# Altium schematic sheet 5V_Source.SchDoc
size A4
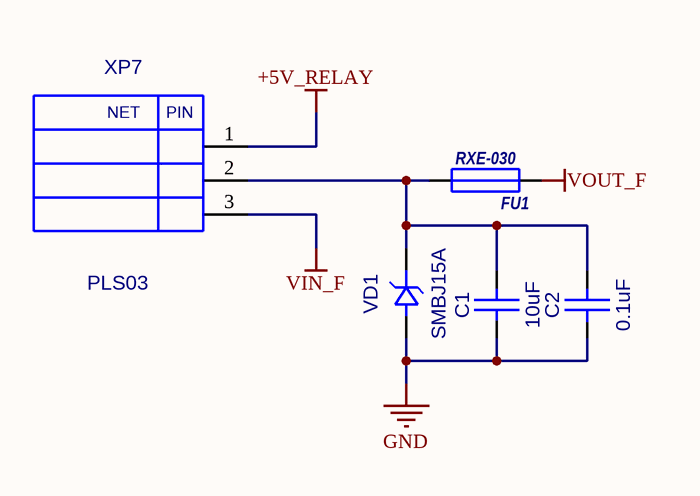
[diagram p0: 5V_Source.SchDoc]

## Parts
C1  10uF  [CC0805]
C2  0.1uF  [CC0603]
FU1  RXE-030  [RXE-110]
VD1  SMBJ15A  [SMB]
XP7  PLS03  [PLS-03]

## Nets
+5V_RELAY: XP7.1
GND: C1.1(A) C2.1(A) VD1.1(A)
VIN_F: XP7.3
VOUT_F: FU1.1
NetC1_2: C1.2(B) C2.2(B) FU1.2 VD1.2(K) XP7.2

## Notes on the sheet
- (in symbol PLS03) NET; PIN

## Library data of the parts
C1 = CC0805: Value: 10uF
C2 = CC0603: Value: 0.1uF
FU1 = RXE-110: Value: RXE-030
VD1 = SMBJ: Value: SMBJ15A
XP7 = PLS03: Value: *